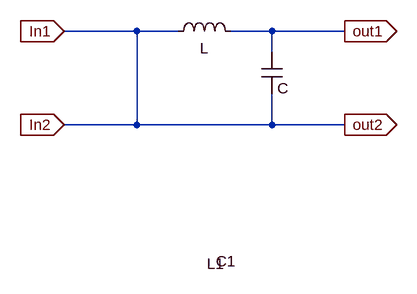
[diagram p0: schematic Draft4.asc]
Draft4.asc, the LTspice schematic file:
Version 4
SHEET 1 880 680
WIRE 48 160 -64 160
WIRE 112 160 48 160
WIRE 256 160 192 160
WIRE 368 160 256 160
WIRE 256 192 256 160
WIRE 48 304 48 160
WIRE 48 304 -64 304
WIRE 256 304 256 256
WIRE 256 304 48 304
WIRE 368 304 256 304
FLAG -64 160 In1
IOPIN -64 160 In
FLAG -64 304 In2
IOPIN -64 304 In
FLAG 368 160 out1
IOPIN 368 160 Out
FLAG 368 304 out2
IOPIN 368 304 Out
SYMBOL ind 96 176 R270
WINDOW 0 -357 73 VTop 2
WINDOW 3 5 56 VBottom 2
SYMATTR InstName L1
SYMBOL cap 240 192 R0
WINDOW 0 -70 322 Left 2
SYMATTR InstName C1

The netlist it stands for:
* Draft4.asc
L1 out2 out1 L
C1 out1 out2 C
.backanno
.end